# EAGLE schematic AURELIA ALIKA (EAGLE 9.6.2)
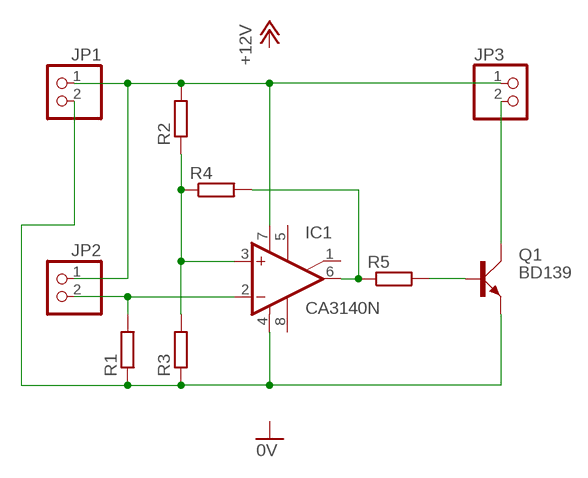
[diagram p0: schematic, sheet 1]

## Parts
IC1  CA3140N  [DIL08]
JP1  PINHD-1X2  [1X02]
JP2  PINHD-1X2  [1X02]
JP3  PINHD-1X2  [1X02]
Q1  BD139  [TO126AV]
R1  R-EU_0207/15  [0207/15]
R2  R-EU_0207/15  [0207/15]
R3  R-EU_0207/15  [0207/15]
R4  R-EU_0207/15  [0207/15]
R5  R-EU_0207/15  [0207/15]

## Nets
N$1: IC1.7(V+) JP1.1 JP2.1 JP3.1 R2.2
N$2: IC1.2(-IN) JP2.2 R1.2
N$3: IC1.4(V-) JP1.2 Q1.E R1.1 R3.1
N$4: IC1.3(+IN) R2.1 R3.2 R4.1
N$5: IC1.6(OUT) R4.2 R5.1
N$6: Q1.B R5.2
N$7: JP3.2 Q1.C
Unconnected: IC1.1(ON/CMP) IC1.5(ON) IC1.8(CMP)

## Library data of the parts
IC1 = linear:CA3140: OP AMP
JP1-JP3 = pinhead:PINHD-1X2: PIN HEADER
Q1 = transistor-power:BD139: NPN TRANSISTOR
R1-R5 = rcl:R-EU_: RESISTOR, European symbol; SPICEPREFIX: R